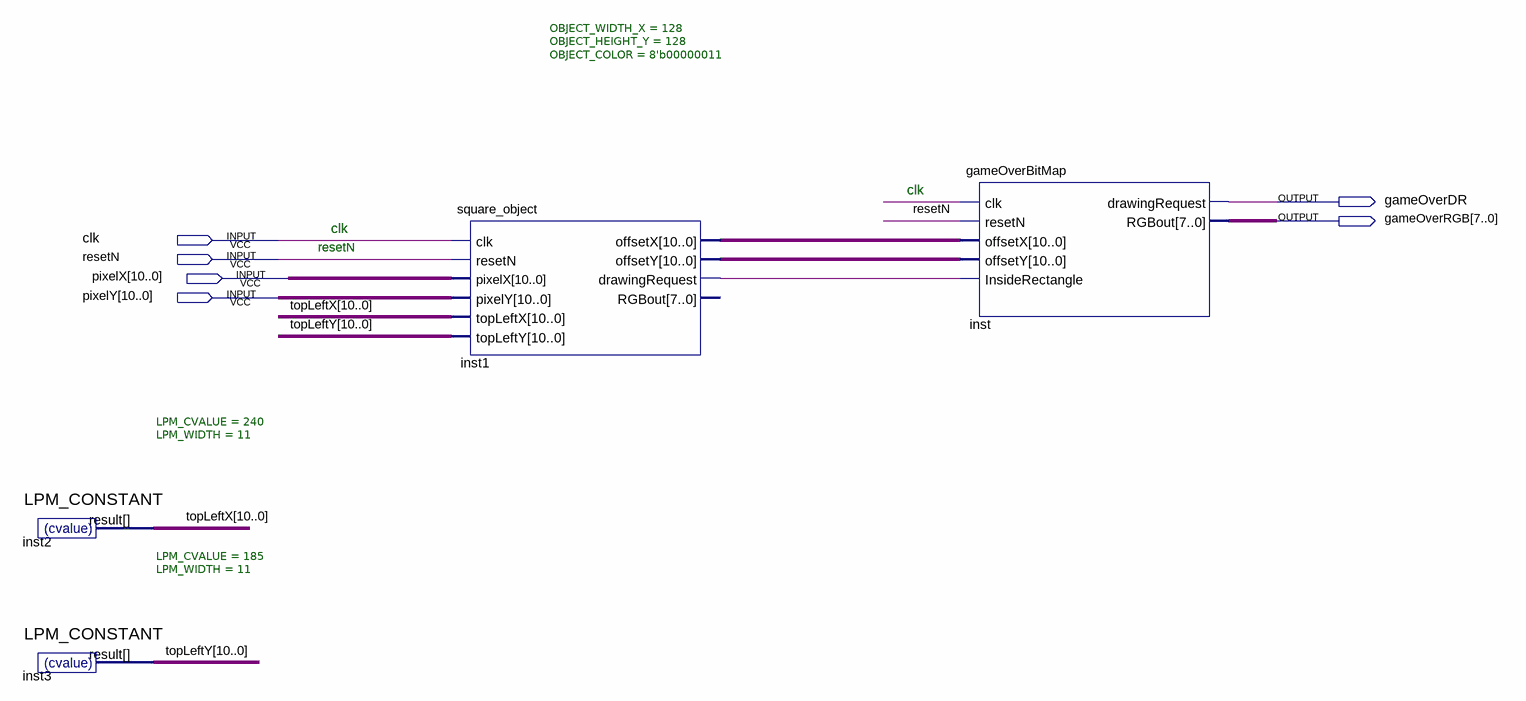
[diagram p0: schematic sheet]
// Quartus schematic GameOver_Block_T.bdf as structural Verilog: 4 symbols, 6 pins
module GameOver_Block_T (
  input  clk,
  input  resetN,
  input  [10:0] pixelX,
  input  [10:0] pixelY,
  output gameOverDR,
  output [7:0] gameOverRGB
);

  wire inst1_drawingrequest;
  wire [10:0] inst1_offsetx, inst1_offsety, topLeftX, topLeftY;

  LPM_CONSTANT #(.LPM_CVALUE(240), .LPM_WIDTH(11)) inst2 (.result(topLeftX));
  LPM_CONSTANT #(.LPM_CVALUE(185), .LPM_WIDTH(11)) inst3 (.result(topLeftY));
  square_object #(.OBJECT_WIDTH_X(128), .OBJECT_HEIGHT_Y(128), .OBJECT_COLOR(8'b00000011)) inst1 (
    .clk(clk), .resetN(resetN), .pixelX(pixelX), .pixelY(pixelY), .topLeftX(topLeftX), .topLeftY(topLeftY),
    .offsetX(inst1_offsetx), .offsetY(inst1_offsety), .drawingRequest(inst1_drawingrequest));  // open: RGBout
  gameOverBitMap inst (
    .clk(clk), .resetN(resetN), .offsetX(inst1_offsetx), .offsetY(inst1_offsety),
    .InsideRectangle(inst1_drawingrequest), .drawingRequest(gameOverDR), .RGBout(gameOverRGB));

  // Notes on the sheet:
  //   clk
  //   clk
  //   resetN
endmodule
